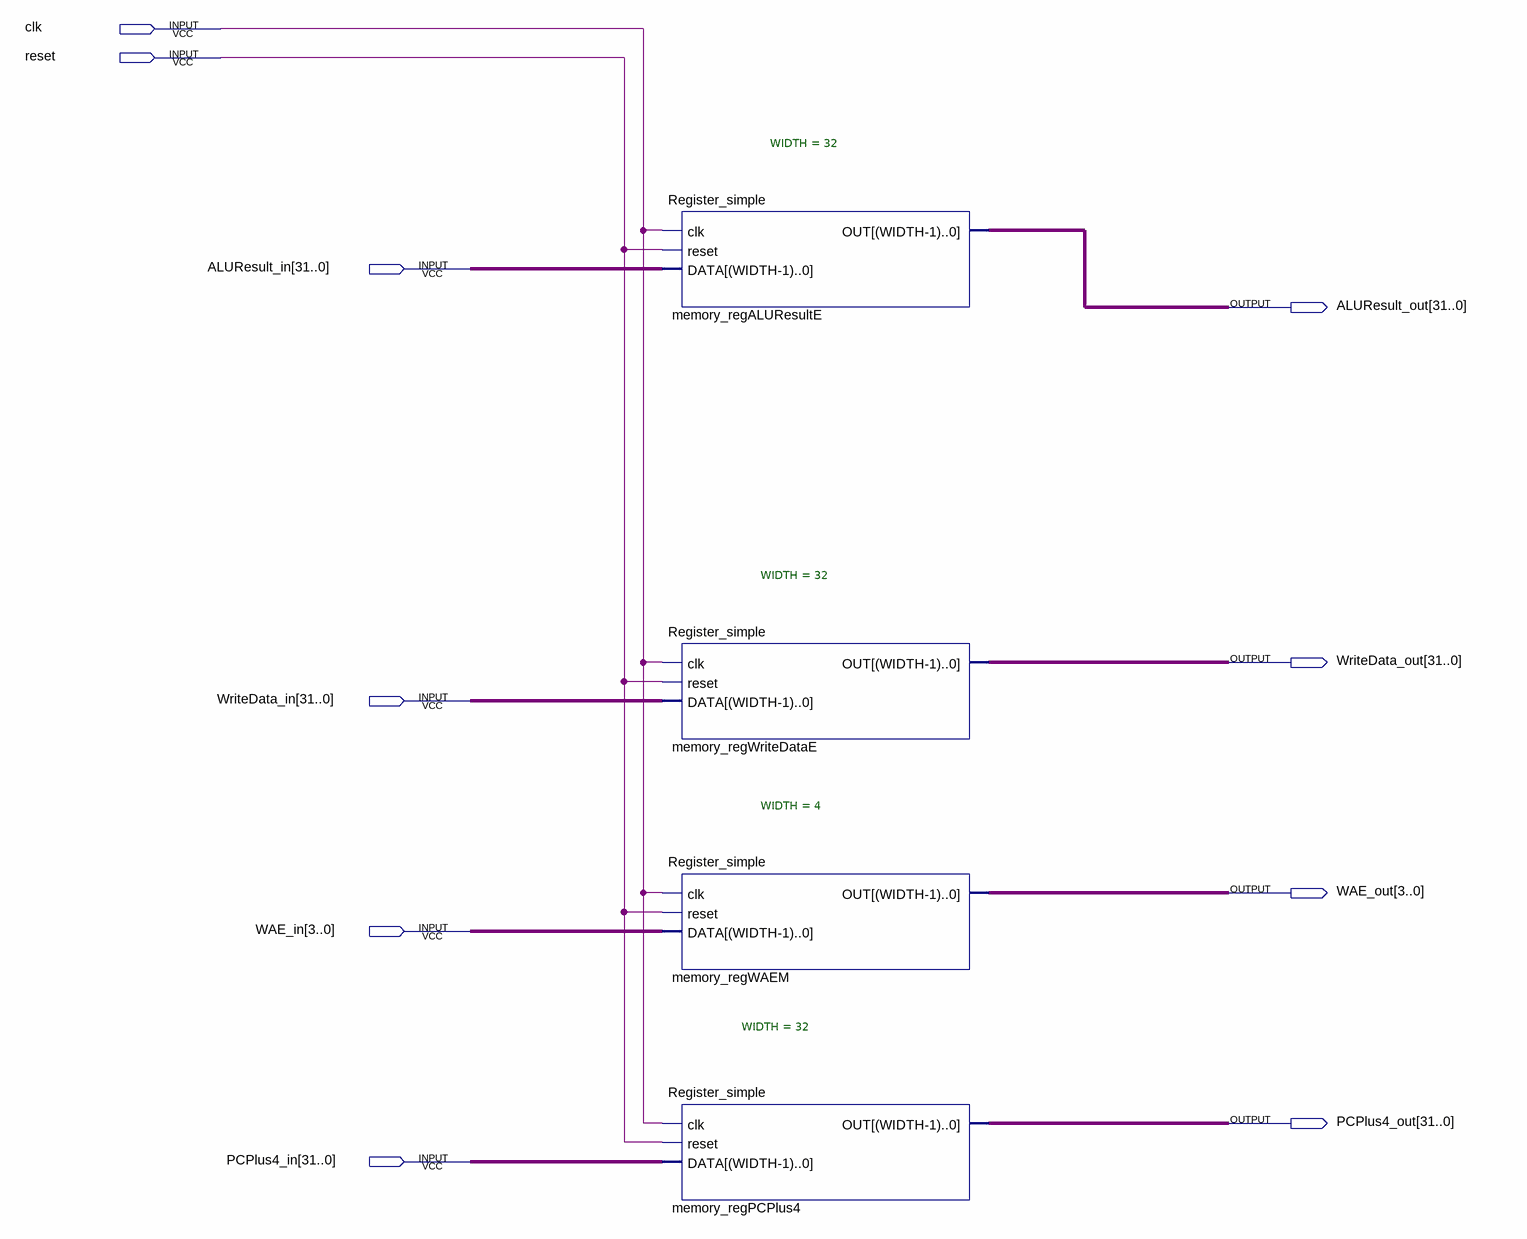
[diagram p0: schematic sheet]
// Quartus schematic memory_register.bdf as structural Verilog: 4 symbols, 10 pins
module memory_register (
  input  clk,
  input  reset,
  input  [31:0] ALUResult_in,
  input  [31:0] WriteData_in,
  input  [3:0] WAE_in,
  input  [31:0] PCPlus4_in,
  output [31:0] ALUResult_out,
  output [31:0] WriteData_out,
  output [3:0] WAE_out,
  output [31:0] PCPlus4_out
);

  Register_simple #(.WIDTH(32)) memory_regALUResultE (
    .clk(clk), .reset(reset), .DATA(ALUResult_in), .OUT(ALUResult_out));
  Register_simple #(.WIDTH(32)) memory_regWriteDataE (
    .clk(clk), .reset(reset), .DATA(WriteData_in), .OUT(WriteData_out));
  Register_simple #(.WIDTH(4)) memory_regWAEM (.clk(clk), .reset(reset), .DATA(WAE_in), .OUT(WAE_out));
  Register_simple #(.WIDTH(32)) memory_regPCPlus4 (.clk(clk), .reset(reset), .DATA(PCPlus4_in), .OUT(PCPlus4_out));
endmodule
